# Altium schematic sheet ETHERNET_RJ45wLED.SchDoc
size A3
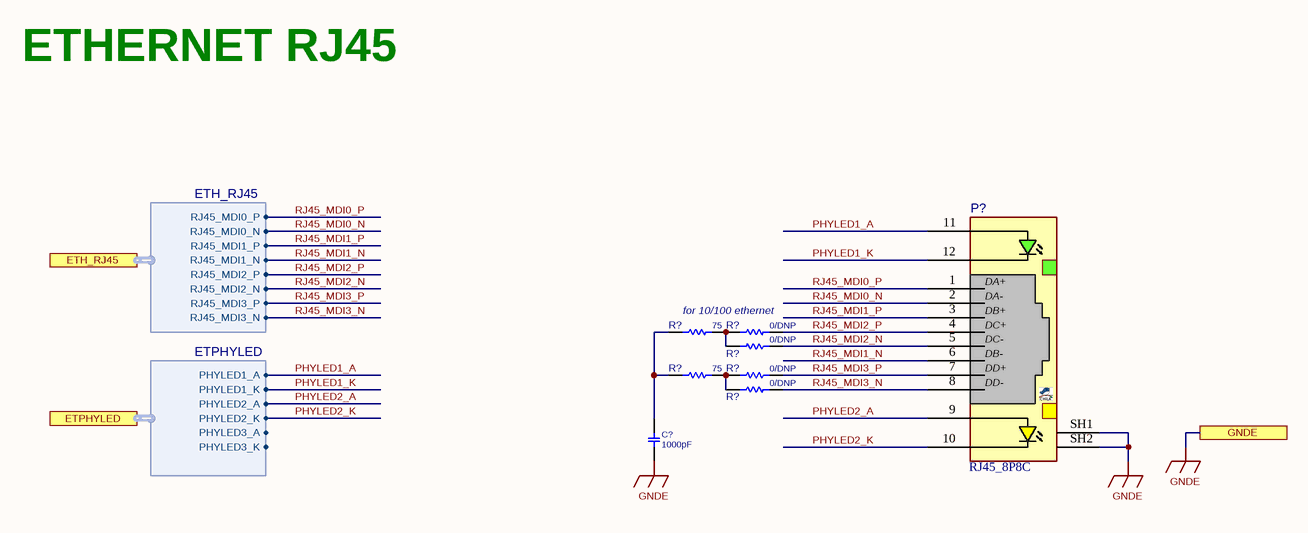
[diagram p0: ETHERNET_RJ45wLED.SchDoc]

## Parts
(Parts that share a designator on the sheet are numbered #1, #2 ... from top to bottom, then left to right.)
C?  1000pF  [C1206]
P?  RJ45_8P8C  [RJ45_8S_RA_TU_L]
R?#1  75  [R0603O]
R?#2  0/DNP  [R0603O]
R?#3  0/DNP  [R0603O]
R?#4  75  [R0603O]
R?#5  0/DNP  [R0603O]
R?#6  0/DNP  [R0603O]

## Ports
ETH_RJ45 (harness ETH_RJ45), ETPHYLED (harness ETPHYLED), GNDE

## Harnesses
ETPHYLED: PHYLED1_A, PHYLED1_K, PHYLED2_A, PHYLED2_K, PHYLED3_A, PHYLED3_K
ETH_RJ45: RJ45_MDI0_P, RJ45_MDI0_N, RJ45_MDI1_P, RJ45_MDI1_N, RJ45_MDI2_P, RJ45_MDI2_N, RJ45_MDI3_P, RJ45_MDI3_N

## Nets
GNDE: C?.2 P?.SH1 P?.SH2 ; port GNDE
PHYLED1_A: P?.11(GLED+) ; port ETPHYLED.PHYLED1_A
PHYLED1_K: P?.12(GLED-) ; port ETPHYLED.PHYLED1_K
PHYLED2_A: P?.9(YLED+) ; port ETPHYLED.PHYLED2_A
PHYLED2_K: P?.10(YLED-) ; port ETPHYLED.PHYLED2_K
RJ45_MDI0_N: P?.2(DA-) ; port ETH_RJ45.RJ45_MDI0_N
RJ45_MDI0_P: P?.1(DA+) ; port ETH_RJ45.RJ45_MDI0_P
RJ45_MDI1_N: P?.6(DB-) ; port ETH_RJ45.RJ45_MDI1_N
RJ45_MDI1_P: P?.3(DB+) ; port ETH_RJ45.RJ45_MDI1_P
RJ45_MDI2_N: P?.5(DC-) R?#3.2 ; port ETH_RJ45.RJ45_MDI2_N
RJ45_MDI2_P: P?.4(DC+) R?#2.2 ; port ETH_RJ45.RJ45_MDI2_P
RJ45_MDI3_N: P?.8(DD-) R?#6.2 ; port ETH_RJ45.RJ45_MDI3_N
RJ45_MDI3_P: P?.7(DD+) R?#5.2 ; port ETH_RJ45.RJ45_MDI3_P
NetC?_1: C?.1 R?#1.1 R?#4.1
NetR?#1_2: R?#1.2 R?#2.1 R?#3.1
NetR?#4_2: R?#4.2 R?#5.1 R?#6.1

## Notes on the sheet
- ETHERNET RJ45
- (near R?#1) for 10/100 ethernet

## Library data of the parts
C? = CAP_SMD_MLCC_22n50V: CAP, MLCC; MANF_P#: 1206B102K202NT; PARAM2: 2kV; MANF: -; PARAM: -; DESC: -; PRICE: $0.006; VALUE: 1000pF
P? = RJ45_8S_RA_TU_L: RJ45, 8P+LED, SHIELDED, RightAngle, TabUP; MANF: WURTH; MANF_P#: 615008137421; PRICE: 1.2$; VALUE: RJ45_8P8C
R?#1 R?#4 = RES_SMD_1K_0402YK: RESISTOR, SMD, THICK FILM, YAGEO; MANF_P#: RC0402FR-071KL; PARAM: 0.063W; DESC: DESCRIPTION; DIST#: MOUSER; PARAM2: 1%; MANF: Yageo; ASSEMBLY: ASSEMBLY; PRICE: 100= 0.3$; VALUE: 75
R?#2 R?#3 R?#5 R?#6 = RES_SMD_10K_0402: RESISTOR, SMD; MANF: Yageo; PARAM: 0.063W; DESC: DESCRIPTION; DIST#: MOUSER; PARAM2: 1%; MANF_P#: RC0402FR-071ML; ASSEMBLY: ASSEMBLY; PRICE: 100= 0.8$; VALUE: 0/DNP